# EAGLE board M837 (EAGLE 6.6.0), part 1 of 2
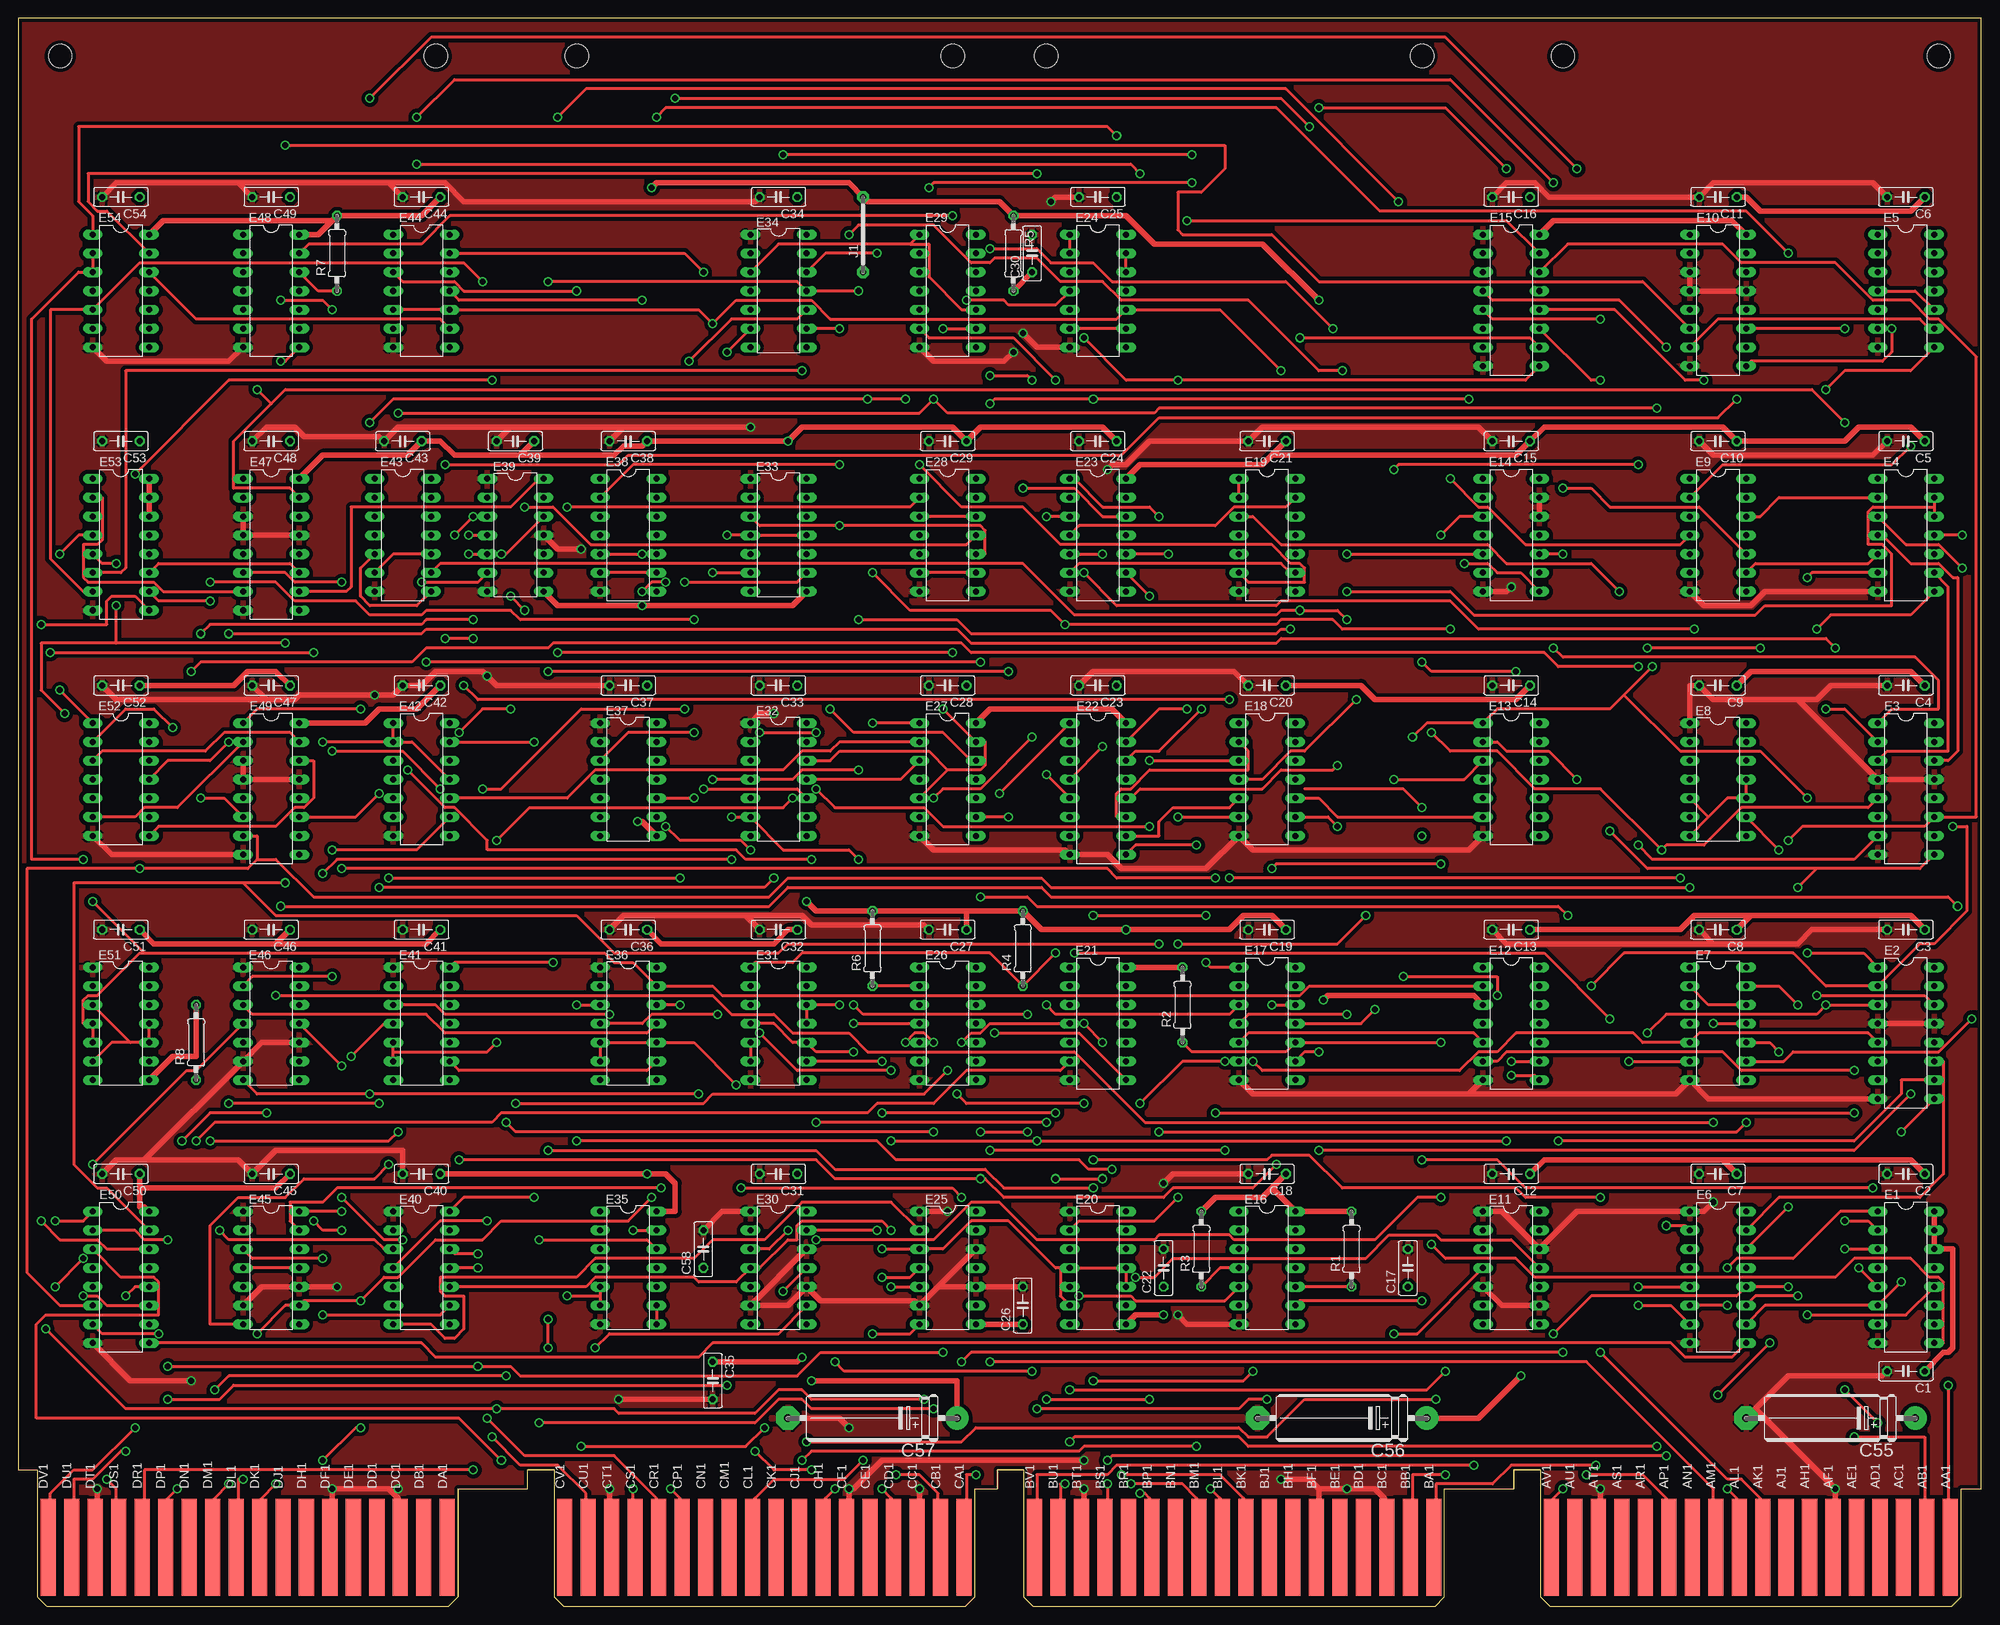
[diagram p7: board, top side]
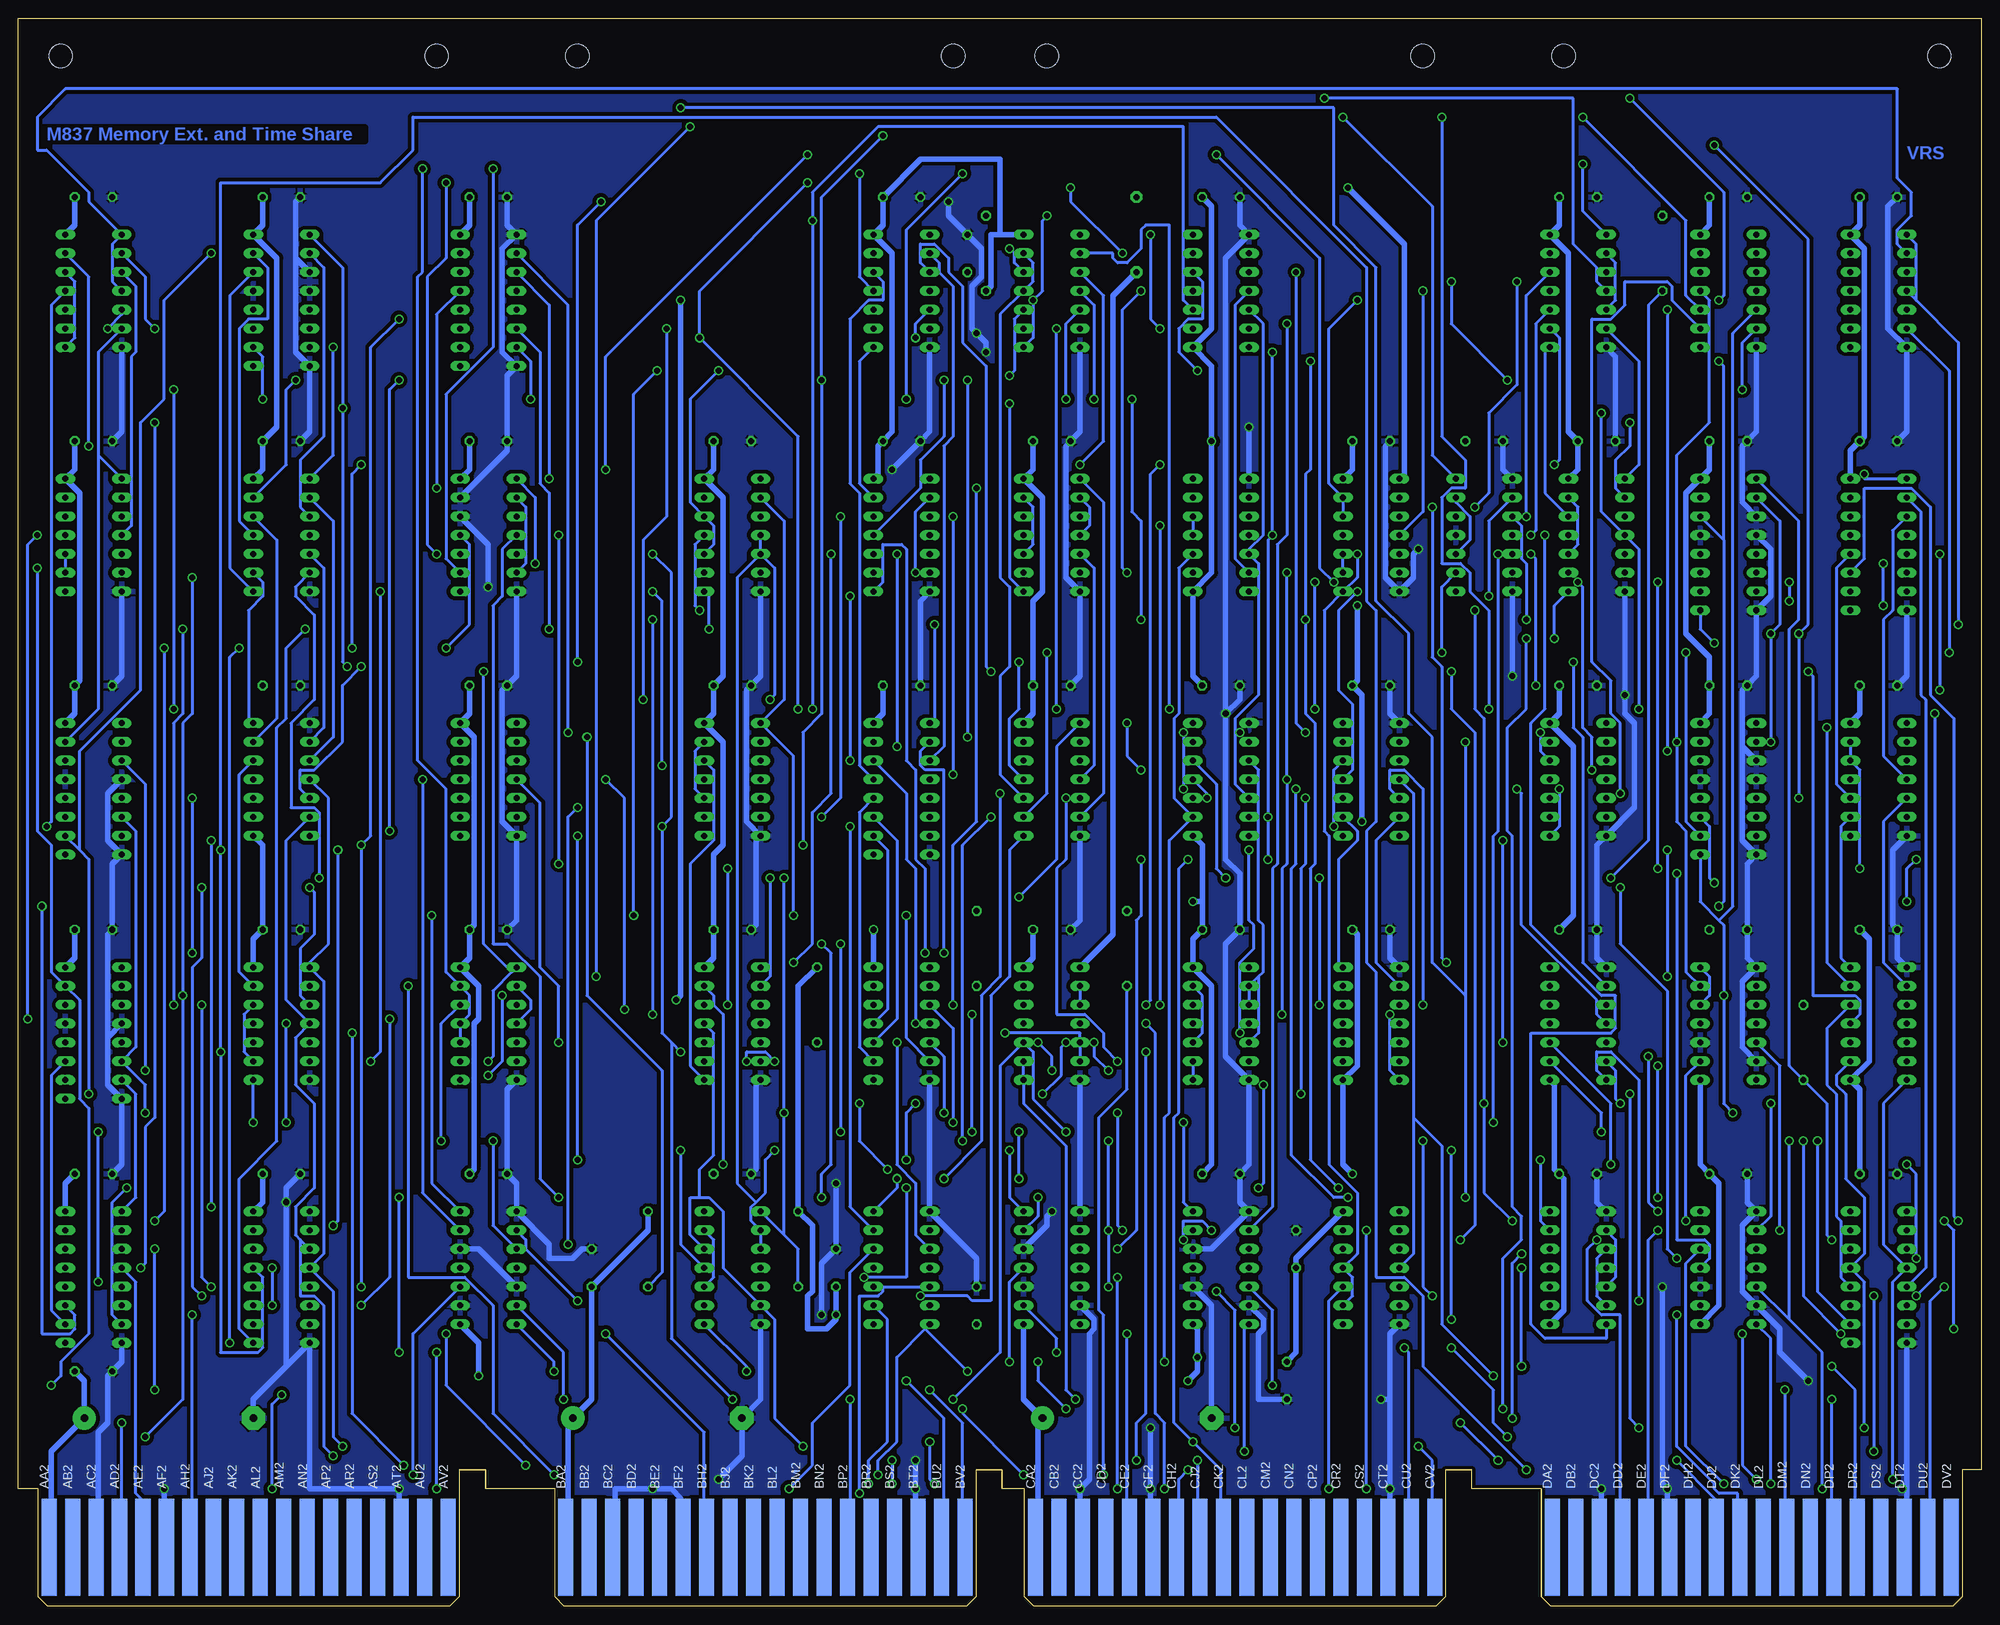
[diagram p8: board, bottom side, seen from below]

Size 265.3 x 214.63 mm. Coordinates in mm from the lower left corner, seen from the top.
Copper layers (1+16): Top 0.035mm / dielectric 1.5mm / Bottom 0.035mm
Design rules "16mils": minimum track width 16mil, minimum drill 32mil, track to track 15mil, track to pad 10mil, pad to pad 10mil, via to via 10mil, smd to smd 10mil, copper to edge 13mil, drill to drill 10mil, minimum pad ring 10mil, minimum via ring 8mil, stop-mask expansion 0mil, vias tented up to drill 0mil, thermal gap 10mil
Net classes: 1 Supply: width 0.762 mm, drill 0.762 mm, clearance 0.508 mm

## Footprints (pad centres in the part's own frame; a part is rotated, then mirrored left to right if it is on the bottom)
C050-025X075 = drill 0.813 octagon: 1 -2.54,0; 2 2.54,0
E22-6 = drill 1.016 pad 3.15: + -11.43,0 | drill 1.016 pad 3.15 octagon: - 11.43,0
DIL16 = drill 0.813 long: 1 -8.89,-3.81; 2 -6.35,-3.81; 3 -3.81,-3.81; 4 -1.27,-3.81; 5 1.27,-3.81; 6 3.81,-3.81; 7 6.35,-3.81; 8 8.89,-3.81; 9 8.89,3.81; 10 6.35,3.81; 11 3.81,3.81; 12 1.27,3.81; 13 -1.27,3.81; 14 -3.81,3.81; 15 -6.35,3.81; 16 -8.89,3.81
DIL14 = drill 0.813 long: 1 -7.62,-3.81; 2 -5.08,-3.81; 3 -2.54,-3.81; 4 0,-3.81; 5 2.54,-3.81; 6 5.08,-3.81; 7 7.62,-3.81; 8 7.62,3.81; 9 5.08,3.81; 10 2.54,3.81; 11 0,3.81; 12 -2.54,3.81; 13 -5.08,3.81; 14 -7.62,3.81
EDGE-CON8 = smd 2.032 x 13.106: AA1 261.303,7.938; AB1 258.127,7.938; AC1 254.952,7.938; AD1 251.778,7.938; AE1 248.602,7.938; AF1 245.428,7.938; AH1 242.252,7.938; AJ1 239.077,7.938; AK1 235.903,7.938; AL1 232.727,7.938; AM1 229.553,7.938; AN1 226.377,7.938; AP1 223.202,7.938; AR1 220.028,7.938; AS1 216.852,7.938; AT1 213.678,7.938; AU1 210.502,7.938; AV1 207.327,7.938; BA1 191.452,7.938; BB1 188.278,7.938; BC1 185.102,7.938; BD1 181.928,7.938; BE1 178.752,7.938; BF1 175.577,7.938; BH1 172.403,7.938; BJ1 169.227,7.938; BK1 166.053,7.938; BL1 162.877,7.938; BM1 159.702,7.938; BN1 156.528,7.938; BP1 153.352,7.938; BR1 150.178,7.938; BS1 147.002,7.938; BT1 143.827,7.938; BU1 140.653,7.938; BV1 137.477,7.938; CA1 127.953,7.938; CB1 124.778,7.938; CC1 121.603,7.938; CD1 118.427,7.938; CE1 115.252,7.938; CF1 112.078,7.938; CH1 108.903,7.938; CJ1 105.728,7.938; CK1 102.552,7.938; CL1 99.377,7.938; CM1 96.203,7.938; CN1 93.028,7.938; CP1 89.853,7.938; CR1 86.677,7.938; CS1 83.502,7.938; CT1 80.328,7.938; CU1 77.153,7.938; CV1 73.978,7.938; DA1 58.102,7.938; DB1 54.928,7.938; DC1 51.752,7.938; DD1 48.578,7.938; DE1 45.403,7.938; DF1 42.227,7.938; DH1 39.053,7.938; DJ1 35.877,7.938; DK1 32.703,7.938; DL1 29.527,7.938; DM1 26.352,7.938; DN1 23.177,7.938; DP1 20.003,7.938; DR1 16.828,7.938; DS1 13.652,7.938; DT1 10.477,7.938; DU1 7.303,7.938; DV1 4.128,7.938 | smd 2.032 x 13.106 bottom: AA2 261.303,7.938; AB2 258.127,7.938; AC2 254.952,7.938; AD2 251.778,7.938; AE2 248.602,7.938; AF2 245.428,7.938; AH2 242.252,7.938; AJ2 239.077,7.938; AK2 235.903,7.938; AL2 232.727,7.938; AM2 229.553,7.938; AN2 226.377,7.938; AP2 223.202,7.938; AR2 220.028,7.938; AS2 216.852,7.938; AT2 213.678,7.938; AU2 210.502,7.938; AV2 207.327,7.938; BA2 191.452,7.938; BB2 188.278,7.938; BC2 185.102,7.938; BD2 181.928,7.938; BE2 178.752,7.938; BF2 175.577,7.938; BH2 172.403,7.938; BJ2 169.227,7.938; BK2 166.053,7.938; BL2 162.877,7.938; BM2 159.702,7.938; BN2 156.528,7.938; BP2 153.352,7.938; BR2 150.178,7.938; BS2 147.002,7.938; BT2 143.827,7.938; BU2 140.653,7.938; BV2 137.477,7.938; CA2 127.953,7.938; CB2 124.778,7.938; CC2 121.603,7.938; CD2 118.427,7.938; CE2 115.252,7.938; CF2 112.078,7.938; CH2 108.903,7.938; CJ2 105.728,7.938; CK2 102.552,7.938; CL2 99.377,7.938; CM2 96.203,7.938; CN2 93.028,7.938; CP2 89.853,7.938; CR2 86.677,7.938; CS2 83.502,7.938; CT2 80.328,7.938; CU2 77.153,7.938; CV2 73.978,7.938; DA2 58.102,7.938; DB2 54.928,7.938; DC2 51.752,7.938; DD2 48.578,7.938; DE2 45.403,7.938; DF2 42.227,7.938; DH2 39.053,7.938; DJ2 35.877,7.938; DK2 32.703,7.938; DL2 29.527,7.938; DM2 26.352,7.938; DN2 23.177,7.938; DP2 20.003,7.938; DR2 16.828,7.938; DS2 13.652,7.938; DT2 10.477,7.938; DU2 7.303,7.938; DV2 4.128,7.938
10 = drill 0.813 pad 1.6 octagon: 1 -5.08,0; 2 5.08,0
0207/10 = drill 0.813 octagon: 1 -5.08,0; 2 5.08,0
OMNIBUS = hole 3.175: 208.915,209.55; 259.715,209.55; 189.865,209.55; 139.065,209.55; 75.616,209.55; 126.416,209.55; 56.566,209.55; 5.766,209.55

## Placement (x,y rotation side)
C1  .01uf  [C050-025X075]  255.14,31.75 180 top
C2  .01uf  [C050-025X075]  255.14,58.42 180 top
C3  .01uf  [C050-025X075]  255.14,91.44 180 top
C4  .01uf  [C050-025X075]  255.14,124.46 180 top
C5  .01uf  [C050-025X075]  255.14,157.48 180 top
C6  .01uf  [C050-025X075]  255.14,190.5 180 top
C7  .01uf  [C050-025X075]  229.74,58.42 180 top
C8  .01uf  [C050-025X075]  229.74,91.44 180 top
C9  .01uf  [C050-025X075]  229.74,124.46 180 top
C10  .01uf  [C050-025X075]  229.74,157.48 180 top
C11  .01uf  [C050-025X075]  229.74,190.5 180 top
C12  .01uf  [C050-025X075]  201.8,58.42 180 top
C13  .01uf  [C050-025X075]  201.8,91.44 180 top
C14  .01uf  [C050-025X075]  201.8,124.46 180 top
C15  .01uf  [C050-025X075]  201.8,157.48 180 top
C16  .01uf  [C050-025X075]  201.8,190.5 180 top
C17  .01uf  [C050-025X075]  187.83,45.72 90 top
C18  .01uf  [C050-025X075]  168.78,58.42 180 top
C19  .01uf  [C050-025X075]  168.78,91.44 180 top
C20  .01uf  [C050-025X075]  168.78,124.46 180 top
C21  .01uf  [C050-025X075]  168.78,157.48 180 top
C22  .01uf  [C050-025X075]  154.81,45.72 90 top
C23  .01uf  [C050-025X075]  145.92,124.46 180 top
C24  .01uf  [C050-025X075]  145.92,157.48 180 top
C25  .01uf  [C050-025X075]  145.92,190.5 180 top
C26  .01uf  [C050-025X075]  135.76,40.64 90 top
C27  .01uf  [C050-025X075]  125.6,91.44 180 top
C28  .01uf  [C050-025X075]  125.6,124.46 180 top
C29  .01uf  [C050-025X075]  125.6,157.48 180 top
C30  .01uf  [C050-025X075]  137.03,182.88 90 top
C31  .01uf  [C050-025X075]  102.74,58.42 180 top
C32  .01uf  [C050-025X075]  102.74,91.44 180 top
C33  .01uf  [C050-025X075]  102.74,124.46 180 top
C34  .01uf  [C050-025X075]  102.74,190.5 180 top
C35  .01uf  [C050-025X075]  93.85,30.48 270 top
C36  .01uf  [C050-025X075]  82.42,91.44 180 top
C37  .01uf  [C050-025X075]  82.42,124.46 180 top
C38  .01uf  [C050-025X075]  82.42,157.48 180 top
C39  .01uf  [C050-025X075]  67.18,157.48 180 top
C40  .01uf  [C050-025X075]  54.48,58.42 180 top
C41  .01uf  [C050-025X075]  54.48,91.44 180 top
C42  .01uf  [C050-025X075]  54.48,124.46 180 top
C43  .01uf  [C050-025X075]  51.94,157.48 180 top
C44  .01uf  [C050-025X075]  54.48,190.5 180 top
C45  .01uf  [C050-025X075]  34.16,58.42 180 top
C46  .01uf  [C050-025X075]  34.16,91.44 180 top
C47  .01uf  [C050-025X075]  34.16,124.46 180 top
C48  .01uf  [C050-025X075]  34.16,157.48 180 top
C49  .01uf  [C050-025X075]  34.16,190.5 180 top
C50  .01uf  [C050-025X075]  13.84,58.42 180 top
C51  .01uf  [C050-025X075]  13.84,91.44 180 top
C52  .01uf  [C050-025X075]  13.84,124.46 180 top
C53  .01uf  [C050-025X075]  13.84,157.48 180 top
C54  .01uf  [C050-025X075]  13.84,190.5 180 top
C55  6.8uf  [E22-6]  244.98,25.4 180 top
C56  6.8uf  [E22-6]  178.94,25.4 180 top
C57  6.8uf  [E22-6]  115.44,25.4 180 top
C58  .01uf  [C050-025X075]  92.58,48.26 90 top
E1  DEC8235  [DIL16]  255.14,44.45 270 top
E2  DEC8271  [DIL16]  255.14,77.47 270 top
E3  DEC8271  [DIL16]  255.14,110.49 270 top
E4  7400N  [DIL14]  255.14,144.78 270 top
E5  7400N  [DIL14]  255.14,177.8 270 top
E6  DEC8235  [DIL16]  229.74,44.45 270 top
E7  N8881N  [DIL14]  229.74,78.74 270 top
E8  SP384N  [DIL14]  229.74,111.76 270 top
E9  7400N  [DIL14]  229.74,144.78 270 top
E10  DEC8271  [DIL16]  229.74,176.53 270 top
E11  SP380N  [DIL14]  201.8,45.72 270 top
E12  7410N  [DIL14]  201.8,78.74 270 top
E13  74S74N  [DIL14]  201.8,111.76 270 top
E14  7400N  [DIL14]  201.8,144.78 270 top
E15  8266  [DIL16]  201.8,176.53 270 top
E16  N8881N  [DIL14]  168.78,45.72 270 top
E17  74S74N  [DIL14]  168.78,78.74 270 top
E18  74H00N  [DIL14]  168.78,111.76 270 top
E19  7400N  [DIL14]  168.78,144.78 270 top
E20  SP380N  [DIL14]  145.92,45.72 270 top
E21  7410N  [DIL14]  145.92,78.74 270 top
E22  DEC8251  [DIL16]  145.92,110.49 270 top
E23  7404N  [DIL14]  145.92,144.78 270 top
E24  7400N  [DIL14]  145.92,177.8 270 top
E25  SP384N  [DIL14]  125.6,45.72 270 top
E26  N8881N  [DIL14]  125.6,78.74 270 top
E27  7404N  [DIL14]  125.6,111.76 270 top
E28  7400N  [DIL14]  125.6,144.78 270 top
E29  7410N  [DIL14]  125.6,177.8 270 top
E30  SP384N  [DIL14]  102.74,45.72 270 top
E31  N8881N  [DIL14]  102.74,78.74 270 top
E32  SP314N  [DIL14]  102.74,111.76 270 top
E33  SP314N  [DIL14]  102.74,144.78 270 top
E34  SP314N  [DIL14]  102.74,177.8 270 top
E35  N8881N  [DIL14]  82.42,45.72 270 top
E36  SP380N  [DIL14]  82.42,78.74 270 top
E37  SP314N  [DIL14]  82.42,111.76 270 top
E38  7420  [DIL14]  82.42,144.78 270 top
E39  SP380N  [DIL14]  67.18,144.78 270 top
E40  SP380N  [DIL14]  54.48,45.72 270 top
E41  SP384N  [DIL14]  54.48,78.74 270 top
E42  7410N  [DIL14]  54.48,111.76 270 top
E43  7420  [DIL14]  51.94,144.78 270 top
E44  7400N  [DIL14]  54.48,177.8 270 top
E45  SP380N  [DIL14]  34.16,45.72 270 top
E46  SP380N  [DIL14]  34.16,78.74 270 top
E47  DEC8271  [DIL16]  34.16,143.51 270 top
E48  7404N  [DIL14]  34.16,177.8 270 top
E49  DEC8271  [DIL16]  34.16,110.49 270 top
E50  DEC8235  [DIL16]  13.84,44.45 270 top
E51  SP384N  [DIL14]  13.84,78.74 270 top
E52  7400N  [DIL14]  13.84,111.76 270 top
E53  8266  [DIL16]  13.84,143.51 270 top
E54  7410N  [DIL14]  13.84,177.8 270 top
EDGE  [EDGE-CON8]  -0.13,0 0 top
J1  J10MM  [10]  114.17,185.42 90 top
R1  1K  [0207/10]  180.21,48.26 90 top
R2  1K  [0207/10]  157.35,81.28 90 top
R3  1K  [0207/10]  159.89,48.26 90 top
R4  1K  [0207/10]  135.76,88.9 90 top
R5  1K  [0207/10]  134.49,182.88 270 top
R6  1K  [0207/10]  115.44,88.9 90 top
R7  1K  [0207/10]  43.05,182.88 90 top
R8  1K  [0207/10]  24,76.2 90 top
U$1  OUTLINE-OMNIBUS  [OMNIBUS]  -0.13,0 0 top

## Tracks (layer width: path | path; a pad name or v marks a point on that pad's centre or on a via)
!!!(DF_ENAB*EMA_DISAB)  (via drill 0.81)
  Top 0.406: 173.86,110.49 187.2,110.49 v189.74,107.95 | v191.01,48.9 192.91,46.99 202.44,46.99 204.98,44.45 245.62,44.45 248.16,46.99 255.78,46.99 258.32,44.45 259.59,44.45 260.22,43.81 260.22,35.56 E1.9
  Bottom 0.406: v189.74,107.95 191.01,106.68 v191.01,48.9
!!(DF_ENAB*EMA_DISAB)  (via drill 0.81)
  Top 0.406: v189.74,60.33 199.9,60.33 203.71,56.52 v250.7,56.52
  Bottom 0.406: v189.74,60.33 v189.74,104.14 | v250.7,56.52 252.6,54.61 252.6,39.37 E1.7
!(GTF+RIB)  (via drill 0.81)
  Top 0.406: E50.9 54.48,35.56 56.39,33.66 91.95,33.66 93.85,35.56 223.39,35.56 225.3,33.66 231.65,33.66 E6.9 | v144.02,139.7 148.46,135.25 170.05,135.25 170.69,135.89 193.55,135.89 197.36,132.08 v226.57,132.08
  Bottom 0.406: E23.2 144.02,147.96 v144.02,139.7 | v226.57,132.08 229.11,129.54 229.11,120.02 230.38,118.75 230.38,62.87 235.46,57.78 235.46,37.47 E6.9
!(IND+RIF)  (via drill 0.81)
  Top 0.406: E6.7 223.39,40.64 v218.95,40.64 | v215.14,79.38 206.25,88.27 v142.75,88.27
  Bottom 0.406: v218.95,40.64 215.14,44.45 v215.14,79.38 | v142.75,88.27 142.75,99.69 144.02,100.97 144.02,113.03 145.29,114.3 145.29,142.88 145.92,143.51 148.46,143.51 148.46,138.43 E23.8
!(LA+TP3)  (via drill 0.81)
  Top 0.406: E49.6 27.81,109.22 v24.64,109.22 | v24.64,131.44 25.91,132.72 54.48,132.72 55.12,133.35 v61.47,133.35 | E10.6 219.58,179.07 175.77,179.07 169.42,185.42 157.35,185.42 156.72,186.06 156.72,191.13 159.89,191.13 163.07,194.31 163.07,197.49 v36.07,197.49
  Bottom 0.406: v24.64,109.22 v24.64,131.44 23.37,132.72 23.37,184.78 v36.07,197.49 | v61.47,133.35 61.47,140.97 62.1,141.6 62.1,146.05 E39.3
!(LA+TP4*LD_CTL)  (via drill 0.81)
  Top 0.406: R3.1 162.43,45.72 E16.4 | E47.6 36.07,139.7 37.34,138.43 v43.69,138.43 | v43.69,99.69 147.19,99.69 148.46,98.42 v161.8,98.42 | v161.8,66.67 v248.16,66.67
  Bottom 0.406: E3.6 249.43,104.78 249.43,75.56 E2.6 248.16,70.48 v248.16,66.67 | 161.8,50.16 159.89,48.26 R3.1 | 161.8,50.16 E16.1 | v43.69,99.69 v43.69,138.43 | 161.8,50.16 v161.8,66.67 v161.8,98.42
![D_IN+D(JMP+JMS)+(F*MD3)(JMP+JMS)]  (via drill 0.81)
  Top 0.406: v208.15,62.87 248.16,62.87 254.51,69.22 254.51,71.12 E2.10
  Bottom 0.406: E12.12 208.15,78.74 v208.15,62.87
!BUF_D_IN  (via drill 0.81)
  Top 0.406: E51.6 12.57,76.2 15.11,76.2 | 15.11,76.2 E51.10 E51.11 | 15.11,76.2 E51.3 | 228.47,106.68 231.01,109.22 E8.10 E8.11 | 228.47,106.68 E8.7 | 228.47,106.68 E8.5 | v23.37,126.36 24.64,127.64 53.21,127.64 55.12,129.54 71.63,129.54 72.26,130.18 127.51,130.18 128.78,128.91 206.25,128.91 208.15,127 v218.95,127
  Bottom 0.406: E51.11 16.38,80.01 16.38,81.92 17.02,82.55 22.73,82.55 22.73,125.73 v23.37,126.36 | v218.95,127 221.49,124.46 221.49,116.84 225.3,113.03 227.2,113.03 227.2,110.49 E8.5
!CDF  (via drill 0.81)
  Top 0.406: E53.7 8.76,137.16 4.32,141.6 4.32,175.26 E54.5 16.38,181.61 60.2,181.61 v62.74,179.07 | E28.11 128.14,143.51 77.34,143.51 72.26,148.59 v68.45,148.59
  Bottom 0.406: v68.45,148.59 66.55,150.5 66.55,161.29 62.74,165.1 v62.74,179.07
!CIF  (via drill 0.81)
  Top 0.406: v131.32,162.56 131.95,163.19 v145.29,163.19 v196.09,163.19 | E54.13 11.94,188.59 10.67,188.59 9.4,189.87 9.4,193.68 v137.67,193.68
  Bottom 0.406: E28.8 131.32,139.06 v131.32,162.56 | v196.09,163.19 196.09,168.28 E15.7 | v137.67,193.68 145.29,186.06 v145.29,163.19
!CINT
  Top 0.406: E24.12 E24.13
  Bottom 0.406: E22.13 151.64,113.67 151.64,150.5 152.91,151.76 152.91,173.99 150.37,176.53 148.46,176.53 148.46,179.07 E24.12
!CPMA_DISABLE  (via drill 0.81)
  Top 0.406: E11.11 201.8,49.53 192.28,49.53 191.64,50.16 185.29,50.16 182.12,46.99 156.08,46.99 153.54,44.45 v151,44.45 | v145.29,56.52 133.22,56.52 130.68,59.05 110.36,59.05 107.82,61.59 v71.63,61.59 | v71.63,34.92 v71.63,38.73 | v64.01,22.86 67.82,19.05 72.9,19.05 76.71,15.24 76.71,8.26 EDGE.CU1
  Bottom 0.406: v151,44.45 145.29,44.45 v145.29,56.52 | v71.63,38.73 v71.63,61.59 | v71.63,34.92 65.91,29.21 65.91,24.77 v64.01,22.86
!CUF  (via drill 0.81)
  Top 0.406: v146.56,116.2 E22.4 | E23.5 v146.56,142.24
  Bottom 0.406: v146.56,142.24 v146.56,116.2
!D  (via drill 0.81)
  Top 0.406: E40.9 57.02,39.37 v41.15,39.37
  Bottom 0.406: v41.15,39.37 41.15,21.59 36.07,16.51 36.07,15.88 35.43,15.24 32.89,15.24 32.89,8.26 EDGE.DK2
!D_IN  (via drill 0.81)
  Top 0.406: E5.10 256.41,177.8 E5.4 | E54.2 E54.3 8.13,180.34 1.78,173.99 1.78,100.97 v8.76,100.97 | E51.5 E51.4 8.76,78.74 8.76,81.92 9.4,82.55 10.67,82.55 16.38,88.27 17.02,88.27 | 17.02,88.27 79.25,88.27 80.52,87 83.06,87 E36.13 93.85,83.82 95.12,82.55 173.23,82.55 174.5,83.82 E12.2 | 17.02,88.27 v10.03,95.25
  Bottom 0.406: E5.4 252.6,179.07 252.6,184.15 E5.1 255.78,189.87 255.78,191.13 261.49,196.85 262.76,196.85 262.76,201.29 258.95,205.1 11.3,205.1 11.3,193.04 9.4,191.13 9.4,187.96 11.3,186.06 11.3,184.15 E54.2 | E12.4 196.09,80.64 196.09,81.92 E12.2 | v8.76,100.97 10.03,99.69 v10.03,95.25
!DATA03  (via drill 0.81)
  Top 0.406: E50.3 13.84,44.45 18.29,44.45 18.92,43.81 18.92,39.37 3.68,39.37 2.41,38.1 2.41,25.4 59.56,25.4 v65.28,19.68 | v70.36,24.77 99.57,24.77 102.74,27.94 105.92,27.94 107.19,26.67 v123.7,26.67 | v127.51,33.02 128.78,34.29 v208.79,34.29 | v208.79,15.88 207.52,14.61 207.52,8.26 EDGE.AV1
  Bottom 0.406: v70.36,24.77 v65.28,19.68 | v123.7,26.67 127.51,30.48 v127.51,33.02 | v208.79,15.88 v208.79,34.29
!DATA05  (via drill 0.81)
  Top 0.406: v147.19,16.51 147.19,8.26 EDGE.BS1 | v147.19,19.68 147.83,20.32 v222.76,20.32
  Bottom 0.406: 227.2,49.53 227.84,50.16 227.84,53.98 225.3,56.52 225.3,67.94 227.84,70.48 227.84,76.83 E7.4 229.11,81.92 229.11,103.5 E8.6 | 227.2,49.53 E6.3 | v147.19,19.68 v147.19,16.51 | v222.76,20.32 224.03,21.59 224.03,40.64 225.3,41.91 227.2,41.91 227.2,49.53
!DATA06  (via drill 0.81)
  Top 0.406: v141.48,16.51 140.84,16.51 140.84,8.26 EDGE.BU1 | v142.11,22.23 142.75,22.86 164.97,22.86 166.24,21.59 v221.49,21.59
  Bottom 0.406: E8.4 223.39,109.22 223.39,89.53 225.93,87 E7.1 224.03,84.45 224.03,47.62 E6.4 222.76,42.55 222.76,22.86 v221.49,21.59 | v141.48,16.51 142.11,17.14 v142.11,22.23
!DATA07  (via drill 0.81)
  Top 0.406: v239.27,43.18 E6.12 232.28,41.91 212.6,41.91 v207.52,36.83 | v240.54,81.28 238,83.82 E7.13 | v196.72,19.05 148.46,19.05 147.19,17.78 137.67,17.78 137.67,8.26 EDGE.BV1
  Bottom 0.406: v239.27,43.18 240.54,44.45 v240.54,81.28 | E8.12 235.46,112.39 235.46,85.72 E7.13 | v196.72,19.05 207.52,29.84 v207.52,36.83
!DATA08  (via drill 0.81)
  Top 0.406: v238,74.93 236.73,76.2 E7.10 | v238,102.23 E8.9 | v61.47,18.41 17.02,18.41 17.02,8.26 EDGE.DR1
  Bottom 0.406: E6.13 232.28,44.45 232.28,34.92 232.92,34.29 238,34.29 v238,74.93 v238,102.23 238,192.41 216.41,192.41 211.96,196.85 211.96,201.29 103.38,201.29 83.06,180.97 83.06,135.89 81.79,134.62 81.79,106.05 83.06,104.78 83.06,87 81.79,85.72 81.79,44.45 77.98,44.45 75.44,41.91 75.44,32.38 v61.47,18.41
!DATA09  (via drill 0.81)
  Top 0.406: v11.94,17.14 13.21,15.88 13.21,8.26 EDGE.DS1
  Bottom 0.406: E51.7 13.21,67.94 13.21,48.9 E50.4 11.94,43.81 v11.94,17.14
!DATA10  (via drill 0.81)
  Top 0.406: v14.48,20.95 13.84,20.95 10.03,17.14 7.49,17.14 7.49,8.26 EDGE.DU1 | v14.48,41.91 15.75,43.18 E50.12
  Bottom 0.406: E50.12 18.92,44.45 18.92,52.07 19.56,52.7 19.56,69.22 20.83,70.48 20.83,78.11 E51.12 | v14.48,41.91 v14.48,20.95
!DATA11  (via drill 0.81)
  Top 0.406: v15.75,24.13 10.03,18.41 7.49,18.41 4.32,15.24 4.32,8.26 EDGE.DV1
  Bottom 0.406: E51.9 19.56,71.75 19.56,70.48 18.29,69.22 18.29,57.78 15.75,55.24 15.75,47.62 E50.13 15.75,43.81 v15.75,24.13
!DF_ENABLE
  Bottom 0.406: E17.8 174.5,73.03 174.5,100.33 171.32,103.5 171.32,113.03 E18.12
!EMA0  (via drill 0.81)
  Top 0.406: v246.89,48.26 E1.3 | v251.33,24.77 v246.89,29.21
  Bottom 0.406: v246.89,29.21 v246.89,48.26 | v251.33,24.77 251.33,8.26 EDGE.AD2
!EMA1
  Bottom 0.406: E1.4 249.43,43.81 249.43,15.24 248.79,14.61 248.79,8.26 EDGE.AE2
!EMA2  (via drill 0.81)
  Top 0.406: E1.12 255.14,39.37 v241.81,39.37
  Bottom 0.406: v241.81,39.37 241.81,8.26 EDGE.AH2
!EXT_LD  (via drill 0.81)
  Top 0.406: v27.18,50.8 28.45,49.53 48.13,49.53 49.4,48.26 E40.3
  Bottom 0.406: E40.6 51.94,41.91 51.94,46.99 E40.3 | E46.5 27.18,73.03 v27.18,50.8
!F  (via drill 0.81)
  Top 0.406: E46.7 32.26,69.22 v47.5,69.22 v91.95,69.22 | E37.10 v91.31,109.22 | v41.15,19.68 45.59,24.13 v46.23,24.13
  Bottom 0.406: v91.95,69.22 91.95,99.69 91.31,100.33 v91.31,109.22 | v41.15,19.68 36.07,14.61 36.07,8.26 EDGE.DJ2 | v46.23,24.13 47.5,25.4 v47.5,69.22
!F_SET  (via drill 0.81)
  Top 0.406: v95.76,29.84 29.08,29.84 27.18,27.94 v20.19,27.94
  Bottom 0.406: E30.5 95.76,40.01 v95.76,29.84 | v20.19,27.94 20.19,8.26 EDGE.DP2
!GTF  (via drill 0.81)
  Top 0.406: E18.4 168.15,111.76 171.96,115.57 173.86,115.57 v180.85,122.56 | v177.67,172.72 171.32,179.07 147.83,179.07 145.29,181.61 139.57,181.61 137.67,183.51 v131.32,183.51
  Bottom 0.406: v180.85,122.56 180.85,144.15 177.67,147.32 v177.67,172.72 | v131.32,183.51 130.68,182.88 130.68,181.61 E29.12
!IBIFDF_CLR  (via drill 0.81)
  Top 0.406: E49.1 32.26,121.28 v46.23,121.28 | v51.31,161.29 121.79,161.29 v123.7,163.19 125.6,161.29 153.54,161.29 154.18,161.93 v221.49,161.93 | R1.1 E16.10 | v220.85,127 217.04,123.19 | 217.04,123.19 215.14,121.28 199.9,121.28 E13.1 190.37,119.38 v188.47,117.47 | E2.1 249.43,88.27 v241.81,88.27 | v241.81,109.22 235.46,115.57 224.66,115.57 217.04,123.19
  Bottom 0.406: v46.23,121.28 46.23,142.88 E43.4 51.31,147.96 v51.31,161.29 | E29.5 123.7,173.35 v123.7,163.19 | E16.13 171.32,49.53 171.32,44.45 E16.10 | v220.85,127 221.49,127.64 v221.49,161.93 221.49,180.97 E10.1 | v241.81,109.22 v241.81,88.27 | R1.1 178.31,45.09 178.31,72.39 188.47,82.55 v188.47,117.47
!IND  (via drill 0.81)
  Top 0.406: E19.2 E19.1 | E50.7 11.3,36.83 v18.92,36.83 | v24,62.87 26.54,65.41 64.01,65.41 65.28,66.67 114.81,66.67 116.08,67.94 123.7,67.94 128.14,72.39 140.84,72.39 E21.6 | v145.29,93.34 v160.53,93.34
  Bottom 0.406: E19.2 161.8,146.69 161.8,122.56 E18.1 160.53,114.94 v160.53,93.34 | v18.92,36.83 24,41.91 v24,62.87 | v145.29,93.34 145.29,76.83 E21.6
!IND1  (via drill 0.81)
  Top 0.406: E30.9 102.74,36.83 79.88,36.83 v77.98,34.92
  Bottom 0.406: v77.98,34.92 77.34,34.29 77.34,8.26 EDGE.CU2
!IND2  (via drill 0.81)
  Top 0.406: v103.38,42.55 E30.11 | v100.84,24.13 98.3,21.59 v76.07,21.59
  Bottom 0.406: v103.38,42.55 100.84,40.01 v100.84,24.13 | v76.07,21.59 74.17,19.68 74.17,8.26 EDGE.CV2
!INITIALIZE  (via drill 0.81)
  Top 0.406: v59.56,60.33 107.82,60.33 110.36,57.78 v130.05,57.78 130.68,57.78 133.22,55.24 154.81,55.24 156.08,56.52 166.88,56.52 v170.05,59.69 | E38.2 83.06,154.31 v111,154.31 | v112.9,81.28 114.17,80.01 v136.4,80.01 | v130.05,64.14 v136.4,64.14
  Bottom 0.406: E40.13 59.56,52.07 v59.56,60.33 | v170.05,59.69 170.05,80.01 171.32,81.28 171.32,82.55 E17.13 | v111,154.31 112.27,153.03 112.27,81.92 v112.9,81.28 | v136.4,64.14 v136.4,80.01 | v130.05,57.78 v130.05,64.14
!INT_IN_PROGRESS  (via drill 0.81)
  Top 0.406: E39.12 65.91,142.24 v65.28,142.24 | v65.91,65.41 67.18,64.14 v123.7,64.14 | v138.94,27.94 v152.91,27.94
  Bottom 0.406: v65.28,142.24 65.28,104.78 65.91,104.14 v65.91,65.41 | v123.7,64.14 128.14,68.58 128.14,74.93 E26.10 132.59,73.03 132.59,34.29 v138.94,27.94 | v152.91,27.94 152.91,8.26 EDGE.BP2
!INT_RQST  (via drill 0.81)
  Top 0.406: v88.14,15.88 89.41,14.61 89.41,8.26 EDGE.CP1
  Bottom 0.406: E35.10 88.14,41.27 v88.14,15.88
!INTERNAL_IO  (via drill 0.81)
  Top 0.406: E31.4 102.11,78.74 104.65,76.2 E31.10 107.82,74.93 v112.9,74.93 | v114.17,19.68 111.63,17.14 102.11,17.14 99.57,14.61 99.57,8.26 EDGE.CL1
  Bottom 0.406: E31.13 105.28,82.55 105.28,77.47 E31.10 | v112.9,74.93 112.9,26.04 114.17,24.77 v114.17,19.68
!IO_PAUSE  (via drill 0.81)
  Top 0.406: E25.4 120.52,44.45 v116.71,44.45 | v116.71,15.88 117.98,14.61 117.98,8.26 EDGE.CD1
  Bottom 0.406: v116.71,15.88 v116.71,44.45
!IR00  (via drill 0.81)
  Top 0.406: v43.69,73.03 E46.11 | v43.69,55.24 49.4,49.53 v51.94,49.53
  Bottom 0.406: v43.69,55.24 v43.69,73.03 | v51.94,49.53 53.21,48.26 53.21,41.27 51.31,39.37 48.77,39.37 48.77,8.26 EDGE.DD2
!IR01  (via drill 0.81)
  Top 0.406: v39.88,52.07 41.15,50.8 v43.69,50.8
  Bottom 0.406: E46.9 39.88,71.75 v39.88,52.07 | v43.69,50.8 44.96,49.53 44.96,8.26 EDGE.DE2
!KEY_CTL  (via drill 0.81)
  Top 0.406: E46.4 24,72.39 22.73,72.39 v10.03,59.69 | v4.95,43.18 v8.76,46.99
  Bottom 0.406: v10.03,59.69 8.76,58.42 v8.76,46.99 | v4.95,43.18 6.86,41.27 6.86,8.26 EDGE.DU2
!LOAD_CNTL  (via drill 0.81)
  Top 0.406: E40.10 76.71,43.18 77.98,44.45 91.31,44.45 91.95,43.81 97.03,43.81 E30.4 100.2,45.72 104.01,49.53 105.28,49.53 105.28,51.44 105.92,52.07 116.71,52.07 v117.98,50.8 | v117.98,43.18 E25.5 | v117.98,62.87 v137.67,62.87 v201.17,62.87 | v133.86,106.68 E27.9 | v126.24,128.91 v72.9,128.91
  Bottom 0.406: v117.98,43.18 v117.98,50.8 v117.98,62.87 | E11.3 201.17,51.44 v201.17,62.87 | v133.86,106.68 137.67,102.87 v137.67,62.87 | E39.9 72.9,137.79 v72.9,128.91 | v126.24,128.91 126.24,109.86 E27.9
!MD00  (via drill 0.81)
  Top 0.406: v87.5,105.41 89.41,103.5 97.66,103.5 v98.93,102.23 | v100.2,77.47 105.28,72.39 v117.98,72.39 | v119.89,76.2 121.16,77.47 122.43,77.47 v123.7,76.2 | v126.87,69.22 128.14,67.94 v144.02,67.94 | v145.29,60.33 168.78,60.33 169.42,60.96 174.5,60.96 178.94,56.52 202.44,56.52 203.71,55.24 v213.87,55.24 | v213.87,34.29 231.01,17.14 232.92,17.14 235.46,14.61 235.46,8.26 EDGE.AK1
  Bottom 0.406: E37.12 87.5,113.03 v87.5,105.41 | v98.93,102.23 98.93,92.71 98.3,92.08 98.3,88.9 100.2,87 v100.2,77.47 | v117.98,72.39 119.89,74.3 v119.89,76.2 | v123.7,76.2 124.33,75.56 124.33,71.75 v126.87,69.22 | v144.02,67.94 145.29,66.67 v145.29,60.33 | v213.87,34.29 v213.87,55.24
!MD01  (via drill 0.81)
  Top 0.406: v84.33,137.16 85.6,138.43 v87.5,138.43 | v158.62,196.22 v103.38,196.22 | v185.93,153.67 186.56,154.31 v218.95,154.31 | v235.46,129.54 v220.22,129.54 | v229.74,28.57 v236.73,35.56 | v231.01,15.88 232.28,14.61 232.28,8.26 EDGE.AL1
  Bottom 0.406: E37.11 84.96,113.03 84.96,121.92 86.87,123.83 86.87,134.62 v84.33,137.16 | v87.5,138.43 89.41,140.34 89.41,182.25 v103.38,196.22 | v158.62,196.22 185.93,168.91 v185.93,153.67 | v218.95,154.31 220.22,153.03 v220.22,129.54 | v235.46,129.54 236.73,128.27 v236.73,35.56 | v229.74,28.57 231.01,27.3 v231.01,15.88
!MD02  (via drill 0.81)
  Top 0.406: v131.32,33.02 211.96,33.02 229.11,15.88 229.11,8.26 EDGE.AM1
  Bottom 0.406: E25.11 131.32,43.81 v131.32,33.02
!MD03  (via drill 0.81)
  Top 0.406: v211.96,17.78 219.58,17.78 222.76,14.61 222.76,8.26 EDGE.AP1
  Bottom 0.406: E11.10 211.96,36.83 v211.96,17.78
!MD04  (via drill 0.81)
  Top 0.406: v149.1,17.78 162.43,17.78 165.61,14.61 165.61,8.26 EDGE.BK1 | v110.36,33.02 111.63,31.75 v137.03,31.75
  Bottom 0.406: E33.10 108.46,140.34 108.46,120.65 109.09,120.02 109.09,109.22 E32.9 109.73,103.5 109.73,66.67 110.36,66.04 v110.36,33.02 | 142.75,37.47 146.56,33.66 146.56,22.23 149.1,19.68 v149.1,17.78 | 142.75,37.47 E20.7 | 142.75,37.47 v137.03,31.75
!MD05  (via drill 0.81)
  Top 0.406: v161.16,15.88 162.43,14.61 162.43,8.26 EDGE.BL1
  Bottom 0.406: E20.12 152.91,45.09 152.91,29.84 157.99,24.77 157.99,19.05 v161.16,15.88
!MD06  (via drill 0.81)
  Top 0.406: v150.37,16.51 157.35,16.51 159.26,14.61 159.26,8.26 EDGE.BM1
  Bottom 0.406: E20.9 147.83,38.73 147.83,22.23 150.37,19.68 v150.37,16.51
!MD07  (via drill 0.81)
  Top 0.406: v151.64,15.24 152.27,15.24 152.91,14.61 152.91,8.26 EDGE.BP1
  Bottom 0.406: E20.5 148.46,43.18 148.46,42.55 149.1,41.91 151.64,41.91 v151.64,15.24
!MD08  (via drill 0.81)
  Top 0.406: v34.8,16.51 32.89,14.61 32.89,8.26 EDGE.DK1
  Bottom 0.406: E45.12 39.88,46.35 39.88,21.59 v34.8,16.51
!MD09  (via drill 0.81)
  Top 0.406: E32.10 105.28,110.49 v92.58,110.49 | v85.6,55.24 82.42,52.07 65.28,52.07 62.74,49.53 56.39,49.53 51.31,44.45 49.4,44.45 v46.23,41.27 38.61,41.27 E45.9 36.07,40.64 v32.26,36.83 | v30.35,17.14 29.72,17.14 29.72,8.26 EDGE.DL1
  Bottom 0.406: v46.23,41.27 46.23,71.12 50.04,74.93 51.94,74.93 51.94,72.39 E41.7 | v92.58,110.49 92.58,100.33 93.22,99.69 93.22,60.96 87.5,55.24 v85.6,55.24 | v30.35,17.14 32.26,19.05 v32.26,36.83
!MD10  (via drill 0.81)
  Top 0.406: v28.45,16.51 26.54,14.61 26.54,8.26 EDGE.DM1 | v50.04,59.69 48.13,57.78 38.61,57.78 36.07,55.24 29.72,55.24 25.91,51.44 25.91,38.1 E45.7
  Bottom 0.406: E45.7 28.45,36.2 v28.45,16.51 | E41.10 50.04,67.94 v50.04,59.69
!MD11  (via drill 0.81)
  Top 0.406: E41.9 59.56,72.39 84.96,72.39 E36.9 | v21.46,15.88 20.19,14.61 20.19,8.26 EDGE.DP1 | v51.31,64.14 50.04,62.87 v25.91,62.87
  Bottom 0.406: 25.91,38.73 21.46,34.29 v21.46,15.88 | 25.91,38.73 E45.5 | E41.9 51.31,66.67 v51.31,64.14 | 25.91,38.73 v25.91,62.87
!POWER_OK  (via drill 0.81)
  Top 0.406: E16.9 173.23,41.27 v189.74,41.27
  Bottom 0.406: v189.74,41.27 196.72,48.26 196.72,49.53 E11.2
!RDF  (via drill 0.81)
  Top 0.406: E4.13 258.95,148.59 | 258.95,148.59 E4.12 | 258.95,148.59 250.7,148.59 250.06,147.96 250.06,143.51 251.97,143.51 253.24,142.24 253.24,135.25 236.09,135.25 234.82,133.99 196.72,133.99 193.55,137.16 v179.58,137.16 | v178.31,113.67 177.67,113.03 170.69,113.03 168.15,110.49 151.64,110.49 150.37,109.22 E22.12
  Bottom 0.406: E21.9 151.64,75.56 151.64,107.31 E22.12 | v179.58,137.16 178.31,135.89 v178.31,113.67
!RIB
  Top 0.406: E18.5 163.7,107.95 156.08,107.95 154.18,106.05 154.18,104.14 E22.10
  Bottom 0.406: E21.11 147.83,80.64 147.83,102.23 E22.10
!RIF
  Top 0.406: E18.2 166.24,115.57 166.24,113.03 152.91,113.03 150.37,110.49 149.1,110.49 148.46,109.86 148.46,106.68 E22.11
  Bottom 0.406: E21.10 146.56,79.38 146.56,103.5 E22.11
!RMF  (via drill 0.81)
  Top 0.406: E53.9 15.75,136.53 12.57,136.53 11.94,135.89 11.94,132.72 v3.05,132.72 | v144.02,171.45 149.73,165.74 v156.72,165.74 203.71,165.74 E15.9 | E22.9 151,102.87 v159.26,102.87 | E54.1 10.03,187.96 8.13,189.87 8.13,200.03 147.19,200.03 v148.46,198.75
  Bottom 0.406: v3.05,132.72 3.05,170.81 8.76,176.53 | E54.4 8.76,176.53 | E54.1 8.76,184.15 8.76,176.53 | E24.5 144.02,173.35 v144.02,171.45 | v159.26,102.87 159.26,118.11 156.72,120.65 v156.72,165.74 156.72,190.5 v148.46,198.75
!RTF  (via drill 0.81)
  Top 0.406: v128.14,176.53 133.22,176.53 133.86,175.9 140.21,175.9 E24.4 | E48.13 39.24,184.15 54.48,184.15 58.29,187.96 v126.24,187.96
  Bottom 0.406: E29.8 128.14,171.45 v128.14,176.53 126.87,177.8 126.87,187.32 v126.24,187.96
!RUN  (via drill 0.81)
  Top 0.406: v166.88,31.75 165.61,30.48 v145.29,30.48
  Bottom 0.406: E16.8 166.88,32.38 v166.88,31.75 | v145.29,30.48 140.21,25.4 140.21,8.26 EDGE.BU2
!SINT
  Top 0.406: E24.2 E24.1
  Bottom 0.406: E22.3 140.21,116.2 140.21,156.84 138.94,158.12 138.94,178.44 140.84,180.34 140.84,181.61 E24.2
!SKIP  (via drill 0.81)
  Top 0.406: v83.06,50.8 E35.13 | v83.06,15.88 83.06,8.26 EDGE.CS1
  Bottom 0.406: v83.06,15.88 v83.06,50.8
!SUF  (via drill 0.81)
  Top 0.406: v138.94,112.39 E22.5 | E23.3 v138.94,147.32
  Bottom 0.406: v138.94,147.32 v138.94,112.39
!TS1  (via drill 0.81)
  Top 0.406: v191.64,27.94 173.86,27.94 168.78,22.86 166.24,22.86 164.97,24.13 129.41,24.13 127.51,22.23 v106.55,22.23 | E39.6 62.1,138.43 v54.48,138.43 | v52.58,113.03 57.66,107.95 58.93,107.95 63.37,103.5 63.37,102.23 97.03,102.23 98.3,100.97 v107.19,100.97
  Bottom 0.406: E11.6 191.64,34.29 v191.64,27.94 | EDGE.CK2 102.74,8.26 102.74,18.41 v106.55,22.23 109.09,24.77 109.09,66.04 108.46,66.67 108.46,99.69 v107.19,100.97 | v54.48,138.43 53.85,137.79 53.85,118.75 52.58,117.47 v52.58,113.03
!TS_DISABLE  (via drill 0.81)
  Top 0.762: v85.6,191.77 86.23,192.41 112.27,192.41 J1.2 114.81,189.87 132.59,189.87 R5.1 149.73,187.96 153.54,184.15 168.15,184.15 v175.77,176.53 | E12.3 196.72,82.55 177.04,82.55 v176.4,81.92
  Bottom 0.762: E38.1 77.98,153.03 77.98,184.15 v85.6,191.77 | v176.4,81.92 175.77,82.55 v175.77,176.53
!USER_MODE  (via drill 0.81)
  Top 0.406: v26.54,29.21 28.45,31.11 v65.91,31.11
  Bottom 0.406: E35.4 76.71,47.62 76.71,66.04 | 76.71,66.04 76.71,109.86 E37.4 | v26.54,29.21 26.54,8.26 EDGE.DM2 | v65.91,31.11 72.9,38.1 72.9,62.23 76.71,66.04
(D_IN+CIF+RMF)  (via drill 0.81)
  Top 0.406: v232.28,163.19 229.74,160.66 154.18,160.66 149.1,155.57 82.42,155.57 81.15,154.31 v57.66,154.31 | E54.12 24,173.99 57.02,173.99 E44.9
  Bottom 0.406: E10.10 232.28,168.91 v232.28,163.19 | v57.66,154.31 57.02,154.94 57.02,171.45 E44.9
C1L  (via drill 0.81)
  Top 0.406: v112.9,78.74 E26.4 | v110.36,15.88 109.09,14.61 109.09,8.26 EDGE.CH1
  Bottom 0.406: v112.9,78.74 111.63,77.47 111.63,26.04 110.36,24.77 v110.36,15.88
CINT  (via drill 0.81)
  Top 0.406: v151.64,193.68 150.37,194.94 v53.85,194.94
  Bottom 0.406: E24.11 151.64,179.71 v151.64,193.68 | v53.85,194.94 53.85,188.59 E44.1
CPMA_DISABLE  (via drill 0.81)
  Top 0.406: v210.69,111.76 206.88,115.57 201.17,115.57 199.9,116.84 E13.2
  Bottom 0.406: E11.13 210.69,55.88 v210.69,111.76
D  (via drill 0.81)
  Top 0.406: E40.14 60.2,55.24 v69.72,55.24 | E42.13 v69.72,116.84 | v201.17,194.31 192.91,202.56 v175.77,202.56
  Bottom 0.406: v69.72,116.84 69.72,82.55 | 69.72,82.55 v69.72,55.24 | E14.9 207.52,141.6 207.52,163.83 201.17,170.18 v201.17,194.31 | v175.77,202.56 87.5,202.56 87.5,186.69 81.79,180.97 81.79,135.89 77.34,131.44 77.34,120.65 74.17,117.47 74.17,87 69.72,82.55
DB
  Top 0.406: E17.5 166.24,77.47 196.72,77.47 E12.5
DB_LOAD  (via drill 0.81)
  Top 0.406: v224.66,98.42 v163.7,98.42
  Bottom 0.406: E17.2 163.7,85.09 v163.7,98.42 | v224.66,98.42 224.66,107.31 225.3,107.95 228.47,107.95 228.47,119.38 225.3,122.56 225.3,133.99 227.84,136.53 227.84,137.79 E9.6
DF_ENABLE  (via drill 0.81)
  Top 0.406: E17.9 173.86,74.93 v175.77,74.93 | v178.31,105.41 177.04,106.68 E18.9 | v179.58,142.24 E14.5 | v129.41,17.78 128.14,17.78 128.14,8.26 EDGE.CA1 | v137.67,26.67 164.97,26.67 166.24,27.94 v168.78,27.94
  Bottom 0.406: 177.04,76.2 178.31,77.47 v178.31,105.41 177.04,106.68 177.04,139.7 v179.58,142.24 | 177.04,76.2 v175.77,74.93 | v129.41,17.78 137.67,26.04 v137.67,26.67 | v168.78,27.94 177.04,36.2 177.04,76.2
ERROR  (via drill 0.81)
  Top 0.406: E37.3 82.42,118.11 v91.31,118.11 | v92.58,180.34 90.04,182.88 E44.13
  Bottom 0.406: v91.31,118.11 92.58,119.38 v92.58,180.34
F  (via drill 0.81)
  Top 0.406: E46.2 31.62,85.09 v42.42,85.09 | v42.42,102.23 53.85,102.23 E42.9
  Bottom 0.406: v42.42,102.23 v42.42,85.09
GND  (via drill 0.81)
  Top 0.762: v10.67,15.88 10.67,8.26 EDGE.DT2 | EDGE.DF2 42.42,8.26 v42.42,15.88 50.04,15.88 50.67,15.24 | 50.67,15.24 51.31,14.61 51.31,8.26 EDGE.DC1 | 50.67,15.24 v51.31,15.88 | E46.10 32.89,76.2 E46.6 17.02,60.33 | E45.6 32.89,43.18 E45.10 v43.05,43.18 | C50.2 13.21,60.33 17.02,60.33 | 17.02,60.33 29.72,60.33 C45.2 34.8,61.59 51.94,61.59 C40.2 | E50.8 15.11,30.48 v23.37,30.48 | C54.2 13.21,192.41 29.72,192.41 | C49.2 29.72,192.41 | 50.04,192.41 C44.2 | 29.72,192.41 50.04,192.41 | C34.2 99.57,189.87 60.2,189.87 57.66,192.41 50.04,192.41 | E39.11 72.9,142.88 v76.07,142.88 | 81.79,159.38 v98.93,159.38 | C38.2 81.79,159.38 | 66.55,159.38 C39.2 | 81.79,159.38 66.55,159.38 | 66.55,159.38 51.31,159.38 C43.2 48.77,158.12 38.61,158.12 37.34,159.38 33.53,159.38 C48.2 | E52.7 12.57,101.6 E49.8 | C37.2 64.64,124.46 v63.37,125.73 62.74,126.36 56.39,126.36 54.48,124.46 C42.2 50.67,123.19 v48.13,123.19 37.97,123.19 37.34,122.56 33.53,122.56 | E47.3 E47.4 E47.13 | E49.3 E49.4 E49.13 | C47.2 33.53,122.56 | C52.2 13.21,122.56 33.53,122.56 | E54.7 11.94,168.28 28.45,168.28 E48.7 | C23.2 145.29,126.36 164.34,126.36 C20.2 | E27.7 123.7,102.23 141.48,102.23 E22.8 147.19,101.6 149.1,99.69 160.53,99.69 E18.7 166.88,102.23 196.09,102.23 E13.7 | E32.1 100.2,120.65 v102.11,120.65 | 98.3,93.34 C32.2 | 98.3,93.34 81.79,93.34 C36.2 | C27.2 122.43,92.08 107.19,92.08 105.92,93.34 98.3,93.34 | v121.79,15.88 121.79,8.26 EDGE.CC1 | 124.33,43.18 E25.6 121.16,41.27 108.46,41.27 E30.10 104.01,40.64 E30.6 E30.12 | 124.33,43.18 E25.10 C26.2 | 124.33,43.18 E25.12 | v125.6,53.34 E25.1 | v79.88,15.88 79.88,8.26 EDGE.CT2 | v144.02,15.88 144.02,8.26 EDGE.BT2
  Top 0.762: EDGE.CF2 112.27,8.26 v112.27,15.88 112.9,15.88 116.71,19.68 v144.02,19.68 | C58.2 95.12,53.34 E30.1 | v112.27,24.13 111,25.4 C57.- | C35.2 v81.15,27.94 | v139.57,189.87 140.21,190.5 C25.2 | v135.76,172.09 137.67,170.18 E24.7 | v134.49,169.54 133.22,168.28 123.7,168.28 E29.7 | E10.3 E10.4 E10.13 | C6.2 250.7,192.41 229.11,192.41 C11.2 206.88,190.5 204.98,192.41 201.17,192.41 C16.2 | C5.2 250.7,155.57 229.11,155.57 C10.2 | E14.13 E14.12 | C15.2 197.36,159.38 168.15,159.38 C21.2 152.91,157.48 149.73,154.31 147.83,154.31 v147.19,153.67 | E3.13 E3.4 240.54,122.56 | E8.1 225.93,124.46 C9.2 229.11,122.56 240.54,122.56 | E9.7 227.84,135.25 234.19,135.25 236.09,137.16 E4.7 | 240.54,122.56 243.08,122.56 244.98,124.46 C4.2 | 229.11,89.53 C8.2 | 229.11,89.53 240.54,89.53 242.44,91.44 C3.2 | E2.13 E2.4 | E2.8 228.47,68.58 E7.7 224.03,69.22 196.09,69.22 | C13.2 201.17,89.53 229.11,89.53 | EDGE.AF2 245.62,8.26 v245.62,15.88 234.82,26.67 | v213.87,15.88 213.87,8.26 EDGE.AT2 | C1.2 251.97,31.11 239.27,31.11 234.82,26.67 | C55.- 234.82,26.67 | 175.77,15.88 175.77,8.26 EDGE.BF2 | 175.77,15.88 v179.58,15.88 183.39,15.88 184.66,14.61 184.66,8.26 EDGE.BC1 | v156.72,39.37 157.99,38.1 E16.7 | 175.77,15.88 174.5,17.14 v170.69,17.14 | E11.5 200.53,40.64 E11.9 | E11.1 200.53,53.34 E11.12 210.69,53.34 E6.1 227.84,53.34 v229.11,54.61 | E17.7 166.88,69.22 196.09,69.22 | E12.7 196.09,69.22 | v154.81,57.15 156.08,58.42 C18.2 | v201.8,137.79 201.17,137.16 E14.7
  Bottom 0.762: 10.03,15.88 10.03,8.26 EDGE.DT2 | 10.03,15.88 E50.8 | 10.03,15.88 v10.67,15.88 | EDGE.DF2 42.42,8.26 v42.42,15.88 43.05,16.51 v43.05,43.18 | v51.31,15.88 51.31,8.26 EDGE.DC1 | E40.1 51.94,54.61 C40.2 | C45.2 31.62,54.61 E45.1 32.26,51.44 32.26,42.55 E45.6 27.18,37.47 27.18,34.29 v23.37,30.48 | C53.2 10.03,158.75 E54.7 12.57,172.72 12.57,189.23 C54.2 | C34.2 100.2,186.69 E34.1 102.11,182.25 v102.11,120.65 | C43.2 49.4,168.91 E44.7 | E39.1 64.64,153.67 C39.2 | C38.2 80.52,156.84 80.52,139.06 E38.7 76.71,139.06 76.71,142.24 v76.07,142.88 | v98.93,159.38 E33.1 | E41.1 51.94,87.63 C41.2 51.94,102.87 E42.7 46.86,107.95 46.86,119.38 48.13,120.65 v48.13,123.19 E43.7 | E51.1 11.3,87.63 C51.2 11.94,92.08 11.94,102.23 E52.7 | E37.1 79.88,120.65 C37.2 | v63.37,125.73 E39.7 | E48.7 30.35,158.75 C48.2 32.26,156.84 32.26,149.22 E47.3 | C52.2 10.03,125.73 E53.8 | 32.26,116.2 E49.3 | 32.26,116.2 32.26,123.83 C47.2 30.35,125.73 E47.8 28.45,136.53 28.45,142.88 E47.4 | 32.26,116.2 32.26,103.5 E49.8 31.62,100.33 C46.2 31.62,87.63 E46.1 32.26,84.45 32.26,75.56 E46.6 | C23.2 143.38,135.89 E23.7 | C19.2 165.61,92.08 165.61,103.5 E18.7 166.88,106.05 166.88,123.83 C20.2 164.97,125.73 E19.7 | C27.2 121.79,92.71 E27.7 | v102.11,120.65 100.2,122.56 C33.2 | E36.1 79.88,87.63 C36.2 | v102.11,120.65 102.11,100.97 100.2,99.06 C32.2 102.11,89.53 102.11,74.3 E31.7 98.93,59.69 C31.2 100.2,54.61 E30.1 104.01,48.26 E30.12 | EDGE.CC1 121.79,8.26 v121.79,15.88 120.52,17.14 120.52,36.83 119.89,37.47 119.89,38.73 E25.6 | E26.7 E25.1 | C26.2 135.76,46.99 E20.1 E21.7 | v125.6,53.34 126.24,52.7 126.24,51.44 E25.12
  Bottom 0.762: E35.7 79.88,36.83 79.88,27.94 | 79.88,27.94 v79.88,15.88 79.88,8.26 EDGE.CT2 | EDGE.BT2 144.02,8.26 v144.02,15.88 v144.02,19.68 | EDGE.CF2 112.27,8.26 v112.27,15.88 v112.27,24.13 | C35.2 97.66,27.94 97.66,36.83 97.03,37.47 97.03,38.73 E30.6 | C57.- 104.01,40.64 E30.10 | v81.15,27.94 79.88,27.94 | v139.57,189.87 139.57,187.96 C30.2 135.13,183.51 135.13,179.71 136.4,178.44 136.4,172.72 v135.76,172.09 134.49,170.81 v134.49,169.54 | E24.7 142.11,158.75 C24.2 v147.19,153.67 | C28.2 121.79,125.73 E28.7 123.7,139.06 123.7,156.84 C29.2 121.79,158.75 E29.7 | C5.2 251.33,158.75 E5.7 | C10.2 225.93,158.75 E10.8 227.84,169.54 227.84,182.25 | C11.2 227.84,189.87 227.84,182.25 | E10.3 227.84,182.25 | C16.2 199.26,186.69 E15.1 199.9,183.51 199.9,169.54 E15.8 199.26,166.37 C15.2 199.26,156.21 E14.13 | C4.2 251.33,125.73 E4.7 | C13.2 197.99,92.71 E13.7 199.9,106.05 199.9,123.83 C14.2 197.99,125.73 E14.7 | C2.2 251.33,59.69 E2.8 253.24,70.48 253.24,76.83 | 253.24,76.83 E2.4 | 253.24,76.83 253.24,90.81 C3.2 252.6,100.33 E3.8 253.24,103.5 253.24,109.86 E3.4 | v245.62,15.88 245.62,8.26 EDGE.AF2 | EDGE.AT2 213.87,8.26 v213.87,15.88 225.93,15.88 E6.8 229.11,32.38 | E1.8 251.33,33.02 C1.2 253.24,31.11 253.24,24.77 254.51,23.5 254.51,8.26 EDGE.AC2 | 229.11,32.38 233.55,27.94 C55.- | C7.2 229.11,56.52 v229.11,54.61 229.11,32.38 | EDGE.BF2 175.77,8.26 175.77,14.61 177.04,15.88 v179.58,15.88 184.66,15.88 184.66,8.26 EDGE.BC1 | E16.7 164.97,27.94 C56.- 167.51,20.32 v170.69,17.14 | v156.72,39.37 156.72,46.35 C22.2 v154.81,57.15 | C18.2 165.61,59.05 165.61,70.48 E17.7 | C17.2 189.1,48.26 190.37,46.99 193.55,46.99 193.55,48.9 E11.1 197.99,57.15 C12.2 199.26,69.85 E12.7
  Bottom 0.762: E11.5 203.07,48.26 E11.12 | E14.12 201.8,143.51 v201.8,137.79
  pour Top (isolate 0.508): -0.13,214.63 265.3,214.63 265.3,15.24 -0.13,15.24
  pour Bottom (isolate 0.508): -0.13,214.63 265.3,214.63 265.3,15.24 -0.13,15.24
IND1L  (via drill 0.81)
  Top 0.406: v138.94,65.41 v107.82,65.41
  Bottom 0.406: E30.14 107.82,54.61 v107.82,65.41 | v138.94,65.41 138.94,78.11 E21.3
IND2L  (via drill 0.81)
  Top 0.406: v116.08,50.8 E30.13 | v140.21,66.67 v116.71,66.67
  Bottom 0.406: v116.08,50.8 116.71,51.44 v116.71,66.67 | v140.21,66.67 140.21,74.3 E21.5
INDH  (via drill 0.81)
  Top 0.406: v217.68,73.66 E7.6 | v216.41,137.16 212.6,140.97 201.17,140.97 198.63,143.51 170.69,143.51 166.88,147.32 E19.3
  Bottom 0.406: v217.68,73.66 216.41,74.93 v216.41,137.16
INITIALIZE  (via drill 0.81)
  Top 0.406: E40.12 58.93,47.62 v62.1,47.62 | v63.37,25.4 68.45,20.32 80.52,20.32 86.23,14.61 86.23,8.26 EDGE.CR1
  Bottom 0.406: v62.1,47.62 63.37,46.35 v63.37,25.4
INT_IN_PROG_MAMS_LD_CTL  (via drill 0.81)
  Top 0.406: E47.10 44.32,137.16 44.96,137.79 44.96,148.59 66.55,148.59 70.36,152.4 E39.14 | v175.77,61.59 248.16,61.59 v255.78,69.22 | v86.23,201.29 87.5,202.56 170.05,202.56 184.02,188.59 233.55,188.59 v239.27,182.88
  Bottom 0.406: E16.11 175.77,48.9 v175.77,61.59 | v255.78,69.22 255.78,100.97 257.05,102.23 | E3.10 257.05,102.23 | E39.14 74.17,155.57 74.17,189.23 v86.23,201.29 | v239.27,182.88 245.62,176.53 245.62,163.19 248.79,160.02 248.79,123.83 257.05,115.57 257.05,102.23
INT_IN_PROGRESS
  Bottom 0.406: E39.10 69.09,144.15 69.09,147.32 70.99,149.22 E39.13
INT_INH  (via drill 0.81)
  Top 0.406: E43.5 46.23,140.34 46.23,136.53 47.5,135.25 53.85,135.25 E43.8 | E50.1 8.76,52.07 v4.95,52.07 | v3.68,37.47 14.48,26.67 v64.64,26.67 80.52,26.67 81.15,26.04 99.57,26.04 102.74,29.21 105.92,29.21 107.19,27.94 v122.43,27.94 | v61.47,130.81 v57.66,130.81
  Bottom 0.406: v4.95,52.07 3.68,50.8 v3.68,37.47 | v122.43,27.94 123.7,29.21 123.7,62.23 129.41,67.94 E26.8 E26.9 | E43.8 57.66,135.25 v57.66,130.81 | v61.47,130.81 61.47,121.28 64.01,118.75 64.01,104.78 63.37,104.14 63.37,53.98 62.1,52.7 62.1,49.53 64.64,46.99 v64.64,26.67
IR01
  Bottom 0.406: E46.12 36.7,82.55 36.7,85.09 E46.14
JMP+JMS  (via drill 0.81)
  Top 0.406: E42.2 v41.15,116.84 | E42.2 E42.1 | E42.11 53.21,116.84 E42.2
  Bottom 0.406: E46.13 39.88,85.72 39.88,104.78 41.15,106.05 v41.15,116.84 41.15,155.57 36.7,160.02 36.7,176.53 E48.11
LA  (via drill 0.81)
  Top 0.406: v163.07,61.59 v131.32,61.59 | v60.83,142.24 E39.5 | v60.2,124.46 62.1,122.56 v163.7,122.56
  Bottom 0.406: E16.3 E16.2 166.24,52.07 166.24,53.98 165.61,54.61 | E25.14 131.32,55.24 v131.32,61.59 | v163.07,61.59 164.34,60.33 164.34,55.88 165.61,54.61 | v60.83,142.24 60.2,141.6 v60.2,124.46 | v163.7,122.56 163.07,123.19 163.07,140.34 E19.5 | E19.5 E19.4 | 165.61,54.61 168.15,57.15 168.15,139.06 E19.5
LOAD_ADDR  (via drill 0.81)
  Top 0.406: v124.97,34.29 108.46,34.29 105.28,31.11 67.82,31.11 66.55,32.38 v62.1,32.38 v20.19,32.38 | v62.1,45.72 E40.11
  Bottom 0.406: E25.9 124.97,36.2 v124.97,34.29 | v20.19,32.38 17.02,29.21 17.02,8.26 EDGE.DR2 | v62.1,32.38 v62.1,45.72
LOAD_CNTL  (via drill 0.81)
  Top 0.406: E11.4 189.1,36.83 v185.93,36.83
  Bottom 0.406: v185.93,36.83 172.59,23.5 172.59,8.26 EDGE.BH2
LOAD_CNTLH  (via drill 0.81)
  Top 0.406: E16.5 163.07,41.27 151,41.27 150.37,41.91 v143.38,41.91
  Bottom 0.406: v143.38,41.91 137.03,41.91 136.4,41.27 133.86,41.27 133.86,82.55 131.32,85.09 131.32,102.23 E27.8
MD03  (via drill 0.81)
  Top 0.406: E36.4 84.33,78.74 85.6,80.01 v94.49,80.01 | v93.85,111.76 E32.4 104.65,111.76 105.92,113.03 v113.54,113.03 | v93.85,139.7 E33.6 | v209.42,93.34 208.15,94.61 137.67,94.61 136.4,95.89 v130.05,95.89 | E27.1 v115.44,119.38
  Bottom 0.406: E33.6 100.84,141.6 100.84,175.9 E34.4 | v94.49,80.01 94.49,99.69 93.85,100.33 v93.85,111.76 v93.85,139.7 | E11.14 209.42,57.15 v209.42,93.34 | v130.05,95.89 124.97,100.97 124.97,116.2 E27.1 | v113.54,113.03 115.44,114.94 v115.44,119.38
MD03L
  Top 0.406: E42.10 74.17,109.22 77.98,113.03 103.38,113.03 105.92,115.57 109.73,115.57 111,116.84 E27.2
MD06  (via drill 0.81)
  Top 0.406: v15.75,153.03 28.45,165.74 v64.01,165.74 | v71.63,179.07 105.28,179.07 E34.11 v113.54,177.8 | v193.55,132.08 178.94,132.08 177.67,133.35 170.69,133.35 170.05,132.72 v141.48,132.72 139.57,134.62 120.52,134.62 v115.44,139.7 | v140.21,57.78 v146.56,57.78 | E22.1 v132.59,109.86
  Bottom 0.406: E53.1 15.75,152.4 v15.75,153.03 | v64.01,165.74 71.63,173.35 v71.63,179.07 | E22.1 141.48,120.02 v141.48,132.72 | v193.55,132.08 193.55,150.5 194.82,151.76 194.82,169.54 E15.6 | E20.14 146.56,56.52 v146.56,57.78 | v140.21,57.78 135.13,62.87 135.13,82.55 132.59,85.09 v132.59,109.86 | v113.54,177.8 116.08,175.26 116.08,140.34 v115.44,139.7
MD07  (via drill 0.81)
  Top 0.406: E53.6 13.84,139.7 14.48,140.34 14.48,167 v105.92,167 | v144.02,78.74 v146.56,76.2 | E15.10 204.34,171.45 v173.23,171.45 | v159.89,121.28 154.18,115.57 151,115.57 E22.14 | E34.12 109.09,182.88 v116.08,182.88 | v123.06,191.77 123.7,192.41 v158.62,192.41
  Bottom 0.406: v105.92,167 108.46,169.54 108.46,172.72 107.19,173.99 105.28,173.99 105.28,179.07 E34.12 | E20.3 144.02,50.16 144.02,57.15 146.56,59.69 v146.56,76.2 | v144.02,78.74 144.02,99.69 145.29,100.97 145.29,109.86 E22.14 | v159.89,121.28 159.89,158.12 v173.23,171.45 173.23,177.8 v158.62,192.41 | v116.08,182.88 123.06,189.87 v123.06,191.77
MD08  (via drill 0.81)
  Top 0.406: E45.13 36.7,52.07 36.7,54.61 41.15,54.61 43.05,56.52 v86.87,56.52 | v90.68,168.28 96.39,173.99 105.28,173.99 E34.10 | E53.10 18.92,135.89 v25.91,135.89 | v25.91,138.43 34.8,138.43 37.34,135.89 45.59,135.89 47.5,133.99 54.48,133.99 55.12,134.62 66.55,134.62 67.82,133.35 v91.31,133.35 | E22.15 154.18,121.28 v157.99,121.28 | E15.15 201.17,187.32 v157.99,187.32
  Bottom 0.406: v86.87,56.52 90.68,60.33 90.68,99.69 90.04,100.33 90.04,119.38 91.31,120.65 v91.31,133.35 91.31,153.03 90.68,153.67 v90.68,168.28 | v25.91,138.43 v25.91,135.89 | v157.99,121.28 v157.99,187.32 157.99,191.13 149.1,200.03 107.82,200.03 107.82,176.53 E34.10
MD09  (via drill 0.81)
  Top 0.406: v43.69,53.34 E45.14 | v44.96,74.3 49.4,78.74 E41.4 | E33.9 105.28,138.43 v90.04,138.43 | v90.04,121.28 76.07,121.28 65.28,110.49 v62.74,110.49
  Bottom 0.406: v43.69,53.34 44.96,54.61 v44.96,74.3 | v90.04,121.28 v90.04,138.43 | v62.74,110.49 62.1,109.86 62.1,92.08 51.94,81.92 51.94,80.01 E41.4
MD10  (via drill 0.81)
  Top 0.406: E32.11 119.25,111.76 E27.3 | v48.77,67.94 v28.45,67.94 | E41.6 50.67,74.93 | 50.67,74.93 E41.5 | v104.65,109.22 103.38,107.95 69.09,107.95 v64.64,103.5 | v64.64,76.2 63.37,74.93 50.67,74.93
  Bottom 0.406: E45.2 28.45,52.7 v28.45,67.94 | v48.77,67.94 49.4,68.58 49.4,72.39 E41.6 | E32.11 104.65,109.86 v104.65,109.22 | v64.64,76.2 v64.64,103.5
MYC1  (via drill 0.81)
  Top 0.406: E21.8 143.38,77.47 v131.95,77.47
  Bottom 0.406: E26.6 E26.5 121.79,77.47 v131.95,77.47
N$1  (via drill 0.81)
  Top 0.406: E35.12 84.96,49.53 v70.36,49.53 | v133.86,126.36 v71.63,126.36
  Bottom 0.406: v70.36,49.53 68.45,51.44 68.45,118.11 71.63,121.28 v71.63,126.36 | v133.86,126.36 134.49,127 134.49,167.64 137.67,170.81 137.67,178.44 139.57,180.34 139.57,182.25 141.48,184.15 143.38,184.15 143.38,181.61 E24.3
N$2
  Bottom 0.762: E26.1 117.35,90.81 117.35,177.16 J1.1
N$3
  Bottom 0.406: E27.10 132.59,112.39 132.59,125.73 131.32,127 131.32,137.79 132.59,139.06 132.59,174.62 E29.11 128.14,179.07 128.14,181.61 E29.13
N$4  (via drill 0.81)
  Top 0.406: E31.1 99.57,87 104.65,87 105.92,88.27 131.32,88.27 R4.1 v140.21,88.27
  Bottom 0.406: E22.2 143.38,115.57 143.38,113.67 142.75,113.03 140.21,113.03 v140.21,88.27
N$5
  Top 0.406: E31.5 E31.6
  Bottom 0.406: E31.3 E31.2 97.66,85.09 | E32.3 97.66,113.03 97.66,92.71 97.03,92.08 97.03,85.72 97.66,85.09 | E31.5 97.66,77.47 97.66,85.09
N$6  (via drill 0.81)
  Top 0.406: v75.44,81.28 E36.3
  Bottom 0.406: v75.44,81.28 75.44,110.49 77.98,113.03 79.88,113.03 79.88,110.49 E37.5
N$8
  Bottom 0.406: E36.2 81.79,87 81.79,103.5 E37.6
N$9
  Bottom 0.406: E36.14 86.87,87 86.87,100.97 84.33,103.5 84.33,104.78 E37.9
N$10  (via drill 0.81)
  Top 0.406: E6.2 225.3,51.44 v222.76,51.44 | E3.5 250.06,107.95 232.92,107.95 227.84,102.87 222.76,102.87 v222.12,102.23 213.87,110.49 204.98,110.49 199.9,115.57 193.55,115.57 v191.01,118.11
  Bottom 0.406: v222.76,51.44 222.12,52.07 v222.12,102.23 | E15.2 191.01,175.9 v191.01,118.11
N$11
  Bottom 0.406: E14.6 196.72,140.97 196.72,148.59 E14.2
N$13  (via drill 0.81)
  Top 0.406: v75.44,177.8 60.2,177.8 58.93,179.07 51.94,179.07 E44.3
  Bottom 0.406: E38.4 75.44,147.96 v75.44,177.8
N$14
  Bottom 0.406: E40.5 49.4,44.45 49.4,49.53 E40.2
N$19  (via drill 0.81)
  Top 0.406: v130.05,127.64 v55.12,127.64
  Bottom 0.406: E41.2 53.85,87 53.85,117.47 55.12,118.75 v55.12,127.64 | v130.05,127.64 130.05,121.28 131.32,120.02 131.32,113.67 E27.11
N$20  (via drill 0.81)
  Top 0.406: v218.95,43.18 E6.5 | v218.95,102.87 220.85,100.97 248.16,100.97 E3.7 | E15.5 199.26,173.99 v213.87,173.99
  Bottom 0.406: v218.95,43.18 v218.95,102.87 217.68,104.14 217.68,170.18 v213.87,173.99
N$21  (via drill 0.81)
  Top 0.406: E44.11 59.56,176.53 v84.33,176.53
  Bottom 0.406: E38.12 E38.13 88.14,151.76 88.14,172.72 v84.33,176.53
N$22  (via drill 0.81)
  Top 0.406: E20.10 E20.11 E20.4 140.84,45.72 | E20.6 140.84,41.91 140.84,45.72 | 140.84,45.72 140.21,45.72 133.86,52.07 128.78,52.07 124.97,48.26 E25.3 v116.71,48.26 | E45.11 E45.4 | v96.39,106.68 E32.6 103.38,102.23 112.27,102.23 v113.54,100.97 | v95.76,144.78 E33.4 E33.11 | v95.76,169.54 E34.6 | v41.15,99.06 43.05,100.97 v96.39,100.97
  Bottom 0.406: E33.12 E33.11 | v95.76,169.54 v95.76,144.78 96.39,144.15 v96.39,106.68 v96.39,100.97 | E45.11 36.7,46.99 36.7,48.9 37.34,49.53 41.15,49.53 v41.15,99.06 | v116.71,48.26 114.17,50.8 114.17,92.71 113.54,93.34 v113.54,100.97
N$23
  Top 0.406: E38.9 E38.6
  Bottom 0.406: E38.9 E38.10
N$24
  Bottom 0.406: E23.13 151.64,151.76 151.64,168.28 E24.8
N$25
  Top 0.406: E43.6 50.67,142.24 E43.10
  Bottom 0.406: E43.13 54.48,148.59 54.48,143.51 E43.10
N$26  (via drill 0.81)
  Top 0.406: E36.6 E36.5 E36.10 91.31,76.2 v97.03,70.48 | v127.51,55.24 126.24,56.52 v97.66,56.52
  Bottom 0.406: E25.13 127.51,52.7 v127.51,55.24 | v97.66,56.52 97.03,57.15 v97.03,70.48
N$27  (via drill 0.81)
  Top 0.406: E34.3 102.74,184.15 120.52,184.15 | E29.1 120.52,184.15 | E29.10 127.51,175.26 123.06,179.71 123.06,184.15 120.52,184.15 | v116.71,73.66 E31.9 | v123.7,109.22 124.97,110.49 130.05,110.49 v137.03,117.47 | v137.03,165.74 136.4,166.37 v131.32,166.37
  Bottom 0.406: E31.9 E31.8 | v116.71,73.66 118.62,75.56 118.62,77.47 121.16,80.01 124.97,80.01 124.97,99.69 123.7,100.97 v123.7,109.22 | v137.03,165.74 v137.03,117.47 | v131.32,166.37 130.68,167 130.68,173.99 E29.10
N$28  (via drill 0.81)
  Top 0.406: E14.8 203.07,139.7 199.9,139.7 198.63,140.97 v195.45,140.97
  Bottom 0.406: v195.45,140.97 195.45,149.86 E14.1
N$29  (via drill 0.81)
  Top 0.406: E41.3 56.39,81.28 57.66,80.01 v79.88,80.01
  Bottom 0.406: v79.88,80.01 79.88,72.39 E36.7
N$32  (via drill 0.81)
  Top 0.406: E23.12 146.56,147.32 142.75,151.13 v135.76,151.13 | v138.94,81.28 140.21,80.01 163.7,80.01 E17.3